# Altium schematic sheet POWER.SchDoc: =ProjectName
size A4; CheckedBy: DatNB; Author: Ven; CompanyName: Nacentech; Organization: IMET
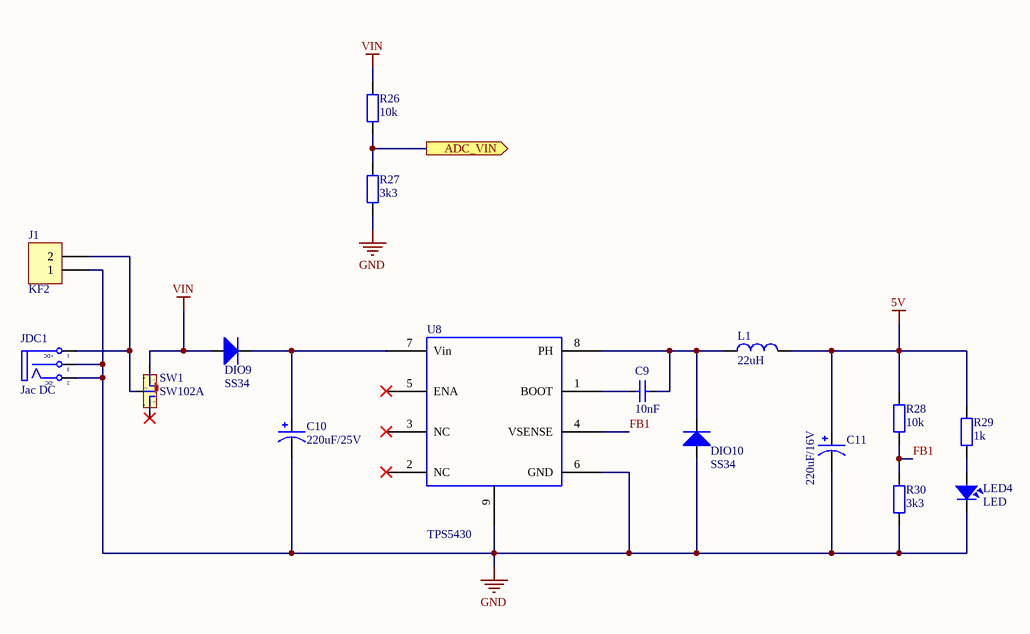
[diagram p0: POWER.SchDoc]

## Parts
C9  10nF  [CAP_0805]
C10  220uF/25V  [C8mm]
C11  220uF/16V  [C8mm]
DIO9  SS34  [DIO-214AC(SMA)]
DIO10  SS34  [DIO-214AC(SMA)]
J1  KF2  [KF2-5.08]
JDC1  Jac DC  [DC-IN]
L1  22uH  [L-SMD-M-7.3x4.5]
LED4  LED  [LED-0805-Red]
R26  10k  [RES-SMD-0805]
R27  3k3  [RES-SMD-0805]
R28  10k  [RES-SMD-0805]
R29  1k  [RES-SMD-0805]
R30  3k3  [RES-SMD-0805]
SW1  SW102A  [SW102]
U8  TPS5430  [ESOP-8]

## Ports
ADC_VIN (out)

## Nets
5V: C11.1 L1.2 R28.1 R29.1
GND: C10.2 C11.2 DIO10.1(A) J1.1 JDC1.2(TN) JDC1.3(S) LED4.2 R27.2 R30.2 U8.6(GND) U8.9(PWR_PAD)
VIN: DIO9.1(A) R26.1 SW1.1
ADC_VIN: R26.2 R27.1 ; port ADC_VIN
FB1: R28.2 R30.1 U8.4(VSENSE)
NetC9_1: C9.1 U8.1(BOOT)
NetC9_2: C9.2 DIO10.2(K) L1.1 U8.8(PH)
NetC10_1: C10.1 DIO9.2(K) U8.7(Vin)
NetJ1_2: J1.2 JDC1.1(T) SW1.2
NetLED4_1: LED4.1 R29.2

Not connected (* = marked no-connect by the designer): SW1 3* 4 5; U8 2(NC)* 3(NC)* 5(ENA)*

## Notes on the sheet
- Project:
- Page Contents:
- Size:
- Date:
- A4
- Checked by:
- Time:
- Revision:
- Sheet
- of
- File:
- (in symbol DCIN) +DC; -DC

## Library data of the parts
C9 = CapSMD: Capacitor; Value: 33p; Published: 8-Jun-2000; LatestRevisionDate: 17-Jul-2002; LatestRevisionNote: Re-released for DXP Platform.; PackageReference: RAD-0.3; Publisher: Altium Limited
C10 C11 = Cap Pol: Polarized Capacitor (Axial); Published: 8-Jun-2000; LatestRevisionDate: 17-Jul-2002; LatestRevisionNote: Re-released for DXP Platform.; PackageReference: POLAR0.8; Publisher: Altium Limited
DIO9 DIO10 = Diode SMD: Default Diode; Code - JEDEC: DO-214-AB; Value: 1N5007; Published: 8-Jun-2000; Revision: July-2002: Re-released for DXP Platform.; Publisher: Altium Limited
J1 = KF2: Manufacturer: Würth Elektronik eiSos GmbH; partNo: 691103110002; ComponentLink1 Description: Manufacturer; ComponentLink2 Description: Datasheet; NoPins: 2; Created Date: 29 October 2013; ComponentLink1URL: http://www.we-online.com; ComponentLink2URL: http://katalog.we-online.de/em/datasheet/6911031100xx.pdf; Created by: Karrer Zheng
JDC1 = DCIN: Jac DC input; Value: Jac DC
L1 = Inductor: Value: 150 mH
LED4 = LED: LED Single colour Green and Red; Value: LED 3 ly Single Colour
R26-R30 = Resistor - SMD: Resistor SMD; Manufacturer: Generic Components; Class: Passive; Published: 08/06/2000; Publisher: Altium Hobart Technology Centre
SW1 = SW102A: Switch 102 on Broad; Value: Switch 102 On Board
U8 = TPS5430: Name: TPS5430